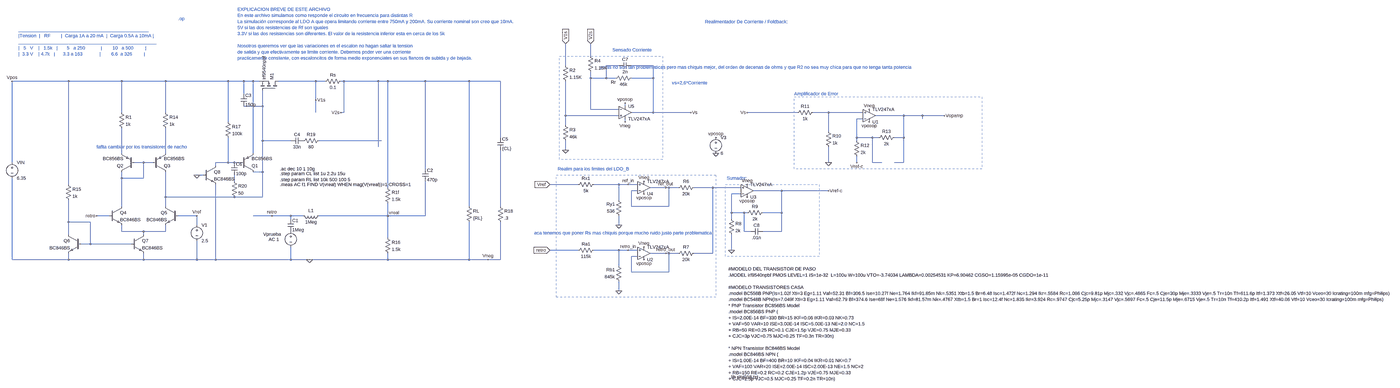
[diagram p0: schematic 2024-09-30 lazo de tension con capas de lazo corriente.asc, whole sheet]
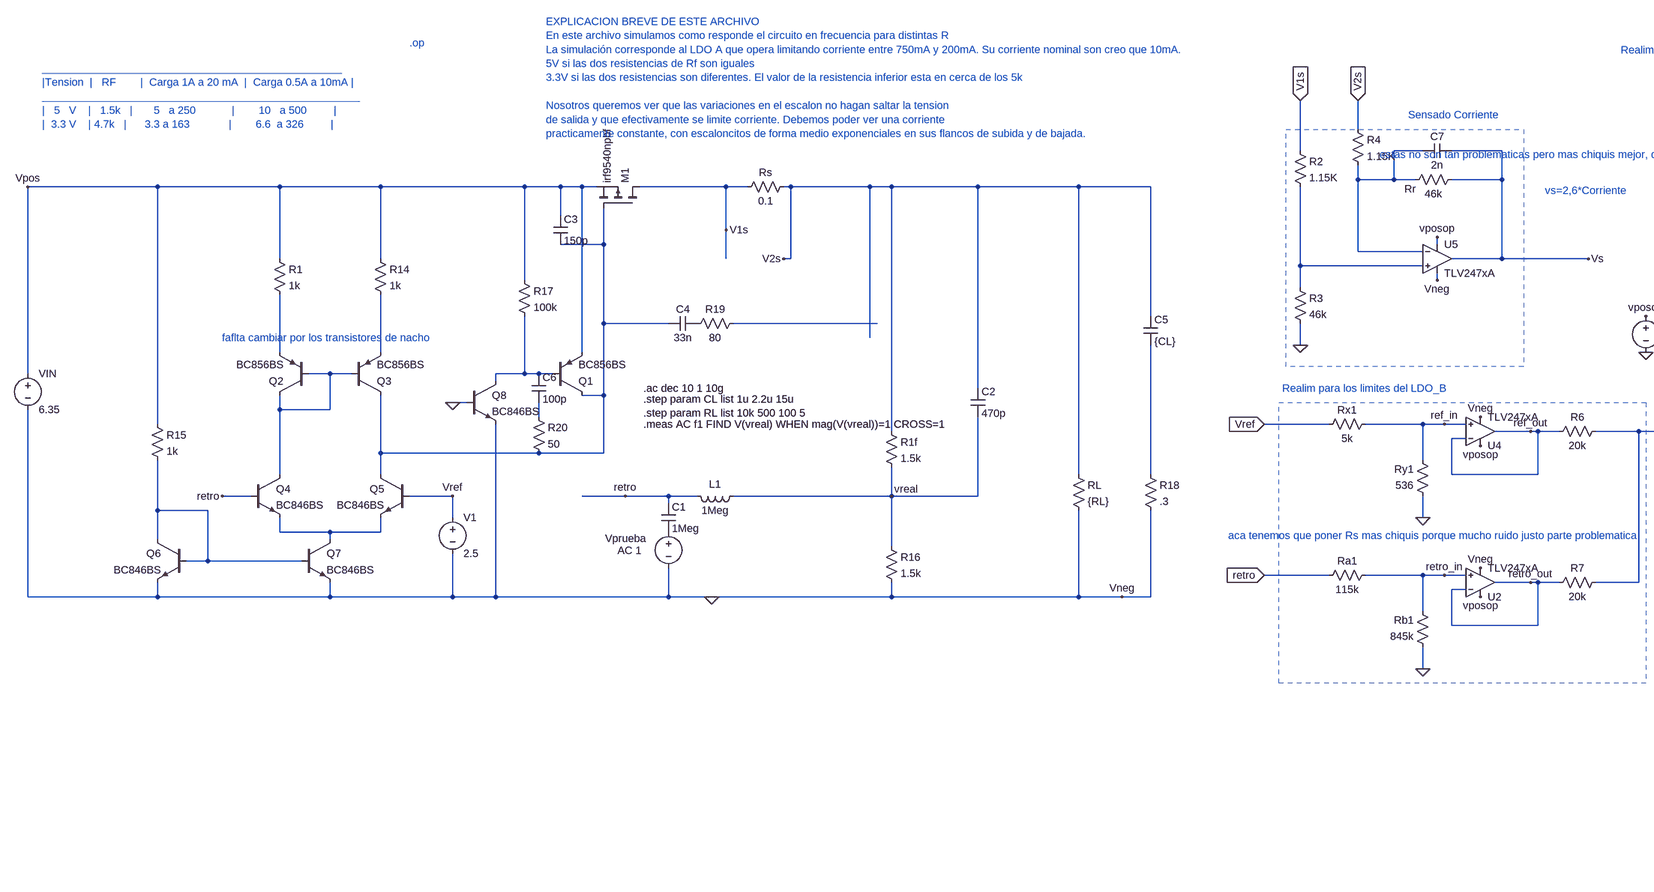
[diagram p1: schematic 2024-09-30 lazo de tension con capas de lazo corriente.asc, part, row 1 of 1, column 1 of 2]
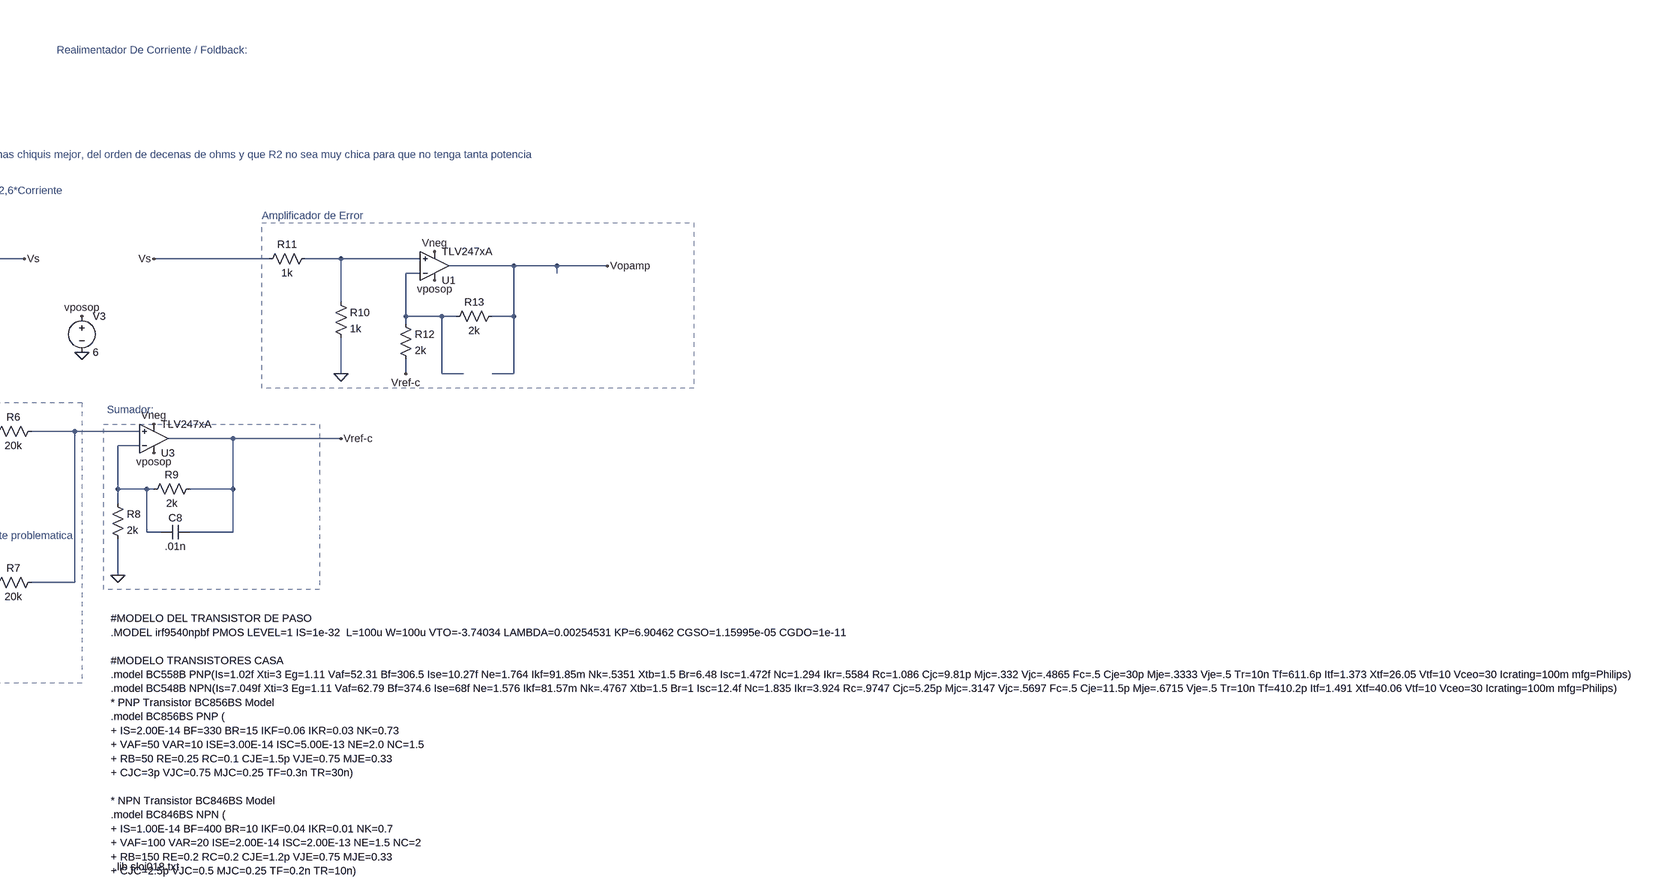
[diagram p2: schematic 2024-09-30 lazo de tension con capas de lazo corriente.asc, part, row 1 of 1, column 2 of 2]
2024-09-30 lazo de tension con capas de lazo corriente.asc, the LTspice schematic file:
Version 4
SHEET 1 6696 2024
WIRE 2176 -160 2176 -224
WIRE 2048 -112 2048 -224
WIRE 2320 -112 2256 -112
WIRE 2496 -112 2384 -112
WIRE 2176 -48 2176 -80
WIRE 2256 -48 2256 -112
WIRE 2256 -48 2176 -48
WIRE 2304 -48 2256 -48
WIRE 2496 -48 2496 -112
WIRE 2496 -48 2384 -48
WIRE -496 -32 -784 -32
WIRE -224 -32 -496 -32
WIRE 0 -32 -224 -32
WIRE 320 -32 0 -32
WIRE 400 -32 320 -32
WIRE 448 -32 400 -32
WIRE 480 -32 448 -32
WIRE 768 -32 576 -32
WIRE 816 -32 768 -32
WIRE 912 -32 896 -32
WIRE 1088 -32 912 -32
WIRE 1136 -32 1088 -32
WIRE 1328 -32 1136 -32
WIRE 1552 -32 1328 -32
WIRE 1712 -32 1552 -32
WIRE 400 32 400 -32
WIRE 768 64 768 -32
WIRE 496 96 496 16
WIRE 496 96 400 96
WIRE 2352 96 2352 80
WIRE 2176 112 2176 -48
WIRE 2320 112 2176 112
WIRE -224 128 -224 -32
WIRE 0 128 0 -32
WIRE 768 128 768 64
WIRE 912 128 912 -32
WIRE 912 128 896 128
WIRE 2496 128 2496 -48
WIRE 2496 128 2384 128
WIRE 2688 128 2496 128
WIRE 3232 128 2976 128
WIRE 3392 128 3312 128
WIRE 3568 128 3392 128
WIRE 2048 144 2048 -32
WIRE 2320 144 2048 144
WIRE 3776 144 3632 144
WIRE 3872 144 3776 144
WIRE 3984 144 3872 144
WIRE 3568 160 3536 160
WIRE 3872 160 3872 144
WIRE 320 176 320 -32
WIRE 2352 176 2352 160
WIRE 2048 192 2048 144
WIRE 3392 224 3392 128
WIRE 1712 256 1712 -32
WIRE 3536 256 3536 160
WIRE 3616 256 3536 256
WIRE 3648 256 3616 256
WIRE 3776 256 3776 144
WIRE 3776 256 3728 256
WIRE 496 272 496 96
WIRE 640 272 496 272
WIRE 1104 272 784 272
WIRE 3536 272 3536 256
WIRE 1088 304 1088 -32
WIRE 2048 320 2048 272
WIRE -224 336 -224 208
WIRE 0 336 0 208
WIRE 448 336 448 -32
WIRE -784 384 -784 -32
WIRE -112 384 -160 384
WIRE -64 384 -112 384
WIRE 320 384 320 256
WIRE 320 384 256 384
WIRE 352 384 320 384
WIRE 384 384 352 384
WIRE 3392 384 3392 304
WIRE 3536 384 3536 352
WIRE 3616 384 3616 256
WIRE 3664 384 3616 384
WIRE 3776 384 3776 256
WIRE 3776 384 3728 384
WIRE 256 400 256 384
WIRE 1328 416 1328 -32
WIRE 496 432 496 272
WIRE 496 432 448 432
WIRE 160 448 144 448
WIRE 192 448 160 448
WIRE -224 464 -224 432
WIRE -112 464 -112 384
WIRE -112 464 -224 464
WIRE 352 480 352 448
WIRE -496 496 -496 -32
WIRE 2112 496 1968 496
WIRE 2320 496 2192 496
WIRE 2368 496 2320 496
WIRE 2416 496 2368 496
WIRE 1136 512 1136 -32
WIRE 2560 512 2480 512
WIRE 2576 512 2560 512
WIRE 2624 512 2576 512
WIRE 2800 512 2704 512
WIRE 2944 512 2800 512
WIRE 2416 528 2384 528
WIRE 3152 528 3008 528
WIRE 3392 528 3152 528
WIRE 2944 544 2896 544
WIRE 0 560 0 432
WIRE 352 560 0 560
WIRE 496 560 496 432
WIRE 496 560 352 560
WIRE 2320 576 2320 496
WIRE -224 608 -224 464
WIRE 0 608 0 560
WIRE 1552 608 1552 -32
WIRE 1712 608 1712 320
WIRE 2384 608 2384 528
WIRE 2576 608 2576 512
WIRE 2576 608 2384 608
WIRE 2896 640 2896 544
WIRE 2960 640 2896 640
WIRE 2976 640 2960 640
WIRE 3152 640 3152 528
WIRE 3152 640 3056 640
WIRE -288 656 -352 656
WIRE 160 656 64 656
WIRE 544 656 448 656
WIRE 640 656 544 656
WIRE 704 656 640 656
WIRE 1136 656 1136 592
WIRE 1136 656 784 656
WIRE 1328 656 1328 480
WIRE 1328 656 1136 656
WIRE 640 672 640 656
WIRE 2896 672 2896 640
WIRE -496 688 -496 576
WIRE -384 688 -496 688
WIRE 160 704 160 656
WIRE 2320 704 2320 656
WIRE -224 736 -224 704
WIRE -112 736 -224 736
WIRE 0 736 0 704
WIRE 0 736 -112 736
WIRE 2960 736 2960 640
WIRE 2992 736 2960 736
WIRE 3152 736 3152 640
WIRE 3152 736 3056 736
WIRE -496 752 -496 688
WIRE -112 752 -112 736
WIRE 1136 768 1136 656
WIRE -384 800 -384 688
WIRE -384 800 -432 800
WIRE -176 800 -384 800
WIRE 2112 832 1968 832
WIRE 2320 832 2192 832
WIRE 2368 832 2320 832
WIRE 2416 832 2368 832
WIRE 2896 832 2896 752
WIRE 2560 848 2480 848
WIRE 2576 848 2560 848
WIRE 2624 848 2576 848
WIRE 2800 848 2800 512
WIRE 2800 848 2704 848
WIRE 2416 864 2384 864
WIRE -784 880 -784 464
WIRE -496 880 -496 848
WIRE -496 880 -784 880
WIRE -112 880 -112 848
WIRE -112 880 -496 880
WIRE 160 880 160 784
WIRE 160 880 -112 880
WIRE 256 880 256 496
WIRE 256 880 160 880
WIRE 640 880 640 816
WIRE 640 880 256 880
WIRE 736 880 640 880
WIRE 1136 880 1136 848
WIRE 1136 880 736 880
WIRE 1552 880 1552 688
WIRE 1552 880 1136 880
WIRE 1648 880 1552 880
WIRE 1712 880 1712 688
WIRE 1712 880 1648 880
WIRE 2320 912 2320 832
WIRE 2384 944 2384 864
WIRE 2576 944 2576 848
WIRE 2576 944 2384 944
WIRE 2320 1040 2320 992
FLAG 736 880 0
FLAG -784 -32 Vpos
FLAG 2688 128 Vs
FLAG 2048 -224 V1s
IOPIN 2048 -224 In
FLAG 2176 -224 V2s
IOPIN 2176 -224 In
FLAG 1968 496 Vref
IOPIN 1968 496 In
FLAG 1968 832 retro
IOPIN 1968 832 In
FLAG 3536 384 Vref-c
FLAG 2352 80 vposop
FLAG 3600 176 vposop
FLAG 2976 560 vposop
FLAG 2448 544 vposop
FLAG 2448 880 vposop
FLAG 2352 176 Vneg
FLAG 3600 112 Vneg
FLAG 2976 496 Vneg
FLAG 2448 816 Vneg
FLAG 2448 480 Vneg
FLAG 1648 880 Vneg
FLAG 2368 496 ref_in
FLAG 2368 832 retro_in
FLAG 2560 848 retro_out
FLAG 2560 512 ref_out
FLAG 160 656 Vref
FLAG 3984 144 Vopamp
FLAG -352 656 retro
FLAG 2048 320 0
FLAG 2320 1040 0
FLAG 2896 832 0
FLAG 3392 384 0
FLAG 2320 704 0
FLAG 3392 528 Vref-c
FLAG 544 656 retro
FLAG 768 64 V1s
FLAG 896 128 V2s
FLAG 2976 128 Vs
FLAG 2816 256 vposop
FLAG 2816 336 0
FLAG 160 448 0
FLAG 1136 656 vreal
DATAFLAG 1040 -32 ""
DATAFLAG 96 -32 ""
DATAFLAG 1216 -32 ""
SYMBOL res 1536 592 R0
SYMATTR InstName RL
SYMATTR Value {RL}
SYMBOL voltage -784 368 R0
WINDOW 123 24 124 Left 2
WINDOW 39 0 0 Left 0
SYMATTR InstName VIN
SYMATTR Value 6.35
SYMBOL res 1120 496 R0
SYMATTR InstName R1f
SYMATTR Value 1.5k
SYMBOL res 912 -48 R90
WINDOW 0 0 56 VBottom 2
WINDOW 3 32 56 VTop 2
SYMATTR InstName Rs
SYMATTR Value 0.1
SYMBOL Res 2032 -128 R0
SYMATTR InstName R2
SYMATTR Value 1.15K
SYMBOL Res 2032 176 R0
SYMATTR InstName R3
SYMATTR Value 46k
SYMBOL Res 2160 -176 R0
SYMATTR InstName R4
SYMATTR Value 1.15K
SYMBOL Res 2400 -64 R90
WINDOW 0 52 108 VBottom 2
WINDOW 3 32 56 VTop 2
SYMATTR InstName Rr
SYMATTR Value 46k
SYMBOL Res 2208 480 R90
WINDOW 0 0 56 VBottom 2
WINDOW 3 32 56 VTop 2
SYMATTR InstName Rx1
SYMATTR Value 5k
SYMBOL Res 2336 672 R180
WINDOW 0 36 76 Left 2
WINDOW 3 36 40 Left 2
SYMATTR InstName Ry1
SYMATTR Value 536
SYMBOL Res 2208 816 R90
WINDOW 0 0 56 VBottom 2
WINDOW 3 32 56 VTop 2
SYMATTR InstName Ra1
SYMATTR Value 115k
SYMBOL Res 2336 1008 R180
WINDOW 0 36 76 Left 2
WINDOW 3 36 40 Left 2
SYMATTR InstName Rb1
SYMATTR Value 845k
SYMBOL Res 2720 496 R90
WINDOW 0 0 56 VBottom 2
WINDOW 3 32 56 VTop 2
SYMATTR InstName R6
SYMATTR Value 20k
SYMBOL Res 2720 832 R90
WINDOW 0 0 56 VBottom 2
WINDOW 3 32 56 VTop 2
SYMATTR InstName R7
SYMATTR Value 20k
SYMBOL Res 2880 656 R0
SYMATTR InstName R8
SYMATTR Value 2k
SYMBOL Res 3072 624 R90
WINDOW 0 0 56 VBottom 2
WINDOW 3 32 56 VTop 2
SYMATTR InstName R9
SYMATTR Value 2k
SYMBOL Res 3376 208 R0
SYMATTR InstName R10
SYMATTR Value 1k
SYMBOL Res 3328 112 R90
WINDOW 0 0 56 VBottom 2
WINDOW 3 32 56 VTop 2
SYMATTR InstName R11
SYMATTR Value 1k
SYMBOL Res 3520 256 R0
SYMATTR InstName R12
SYMATTR Value 2k
SYMBOL Res 3744 240 R90
WINDOW 0 0 56 VBottom 2
WINDOW 3 32 56 VTop 2
SYMATTR InstName R13
SYMATTR Value 2k
SYMBOL pnp -160 432 R180
SYMATTR InstName Q2
SYMATTR Value BC856BS
SYMBOL pnp -64 432 M180
SYMATTR InstName Q3
SYMATTR Value BC856BS
SYMBOL npn -288 608 R0
SYMATTR InstName Q4
SYMATTR Value BC846BS
SYMBOL npn 64 608 M0
SYMATTR InstName Q5
SYMATTR Value BC846BS
SYMBOL res -240 112 R0
SYMATTR InstName R1
SYMATTR Value 1k
SYMBOL res -16 112 R0
SYMATTR InstName R14
SYMATTR Value 1k
SYMBOL res -512 480 R0
SYMATTR InstName R15
SYMATTR Value 1k
SYMBOL npn -432 752 M0
SYMATTR InstName Q6
SYMATTR Value BC846BS
SYMBOL npn -176 752 R0
SYMATTR InstName Q7
SYMATTR Value BC846BS
SYMBOL pmos 576 16 M270
SYMATTR InstName M1
SYMATTR Value irf9540npbf
SYMBOL voltage 640 720 R0
WINDOW 0 -141 30 Left 2
WINDOW 3 10 39 Left 2
WINDOW 123 -113 57 Left 2
WINDOW 39 0 0 Left 0
SYMATTR InstName Vprueba
SYMATTR Value ""
SYMATTR Value2 AC 1
SYMBOL pnp 384 432 M180
SYMATTR InstName Q1
SYMATTR Value BC856BS
SYMBOL npn 192 400 R0
SYMATTR InstName Q8
SYMATTR Value BC846BS
SYMBOL res 304 160 R0
SYMATTR InstName R17
SYMATTR Value 100k
SYMBOL opamp2 2976 592 M180
SYMATTR InstName U3
SYMATTR Value TLV247xA
SYMBOL opamp2 2448 912 M180
SYMATTR InstName U2
SYMATTR Value TLV247xA
SYMBOL opamp2 2448 576 M180
SYMATTR InstName U4
SYMATTR Value TLV247xA
SYMBOL opamp2 2352 64 R0
SYMATTR InstName U5
SYMATTR Value TLV247xA
SYMBOL opamp2 3600 208 M180
SYMATTR InstName U1
SYMATTR Value TLV247xA
SYMBOL Cap 384 32 R0
SYMATTR InstName C3
SYMATTR Value 150p
SYMBOL res 1120 752 R0
SYMATTR InstName R16
SYMATTR Value 1.5k
SYMBOL Cap 1696 256 R0
SYMATTR InstName C5
SYMATTR Value {CL}
SYMBOL cap 1312 416 R0
SYMATTR InstName C2
SYMATTR Value 470p
SYMBOL res 1696 592 R0
SYMATTR InstName R18
SYMATTR Value .3
SYMBOL voltage 2816 240 R0
SYMATTR InstName V3
SYMATTR Value 6
SYMBOL cap 704 256 R90
WINDOW 0 0 32 VBottom 2
WINDOW 3 32 32 VTop 2
SYMATTR InstName C4
SYMATTR Value 33n
SYMBOL res 800 256 R90
WINDOW 0 0 56 VBottom 2
WINDOW 3 32 56 VTop 2
SYMATTR InstName R19
SYMATTR Value 80
SYMBOL cap 336 384 R0
SYMATTR InstName C6
SYMATTR Value 100p
SYMBOL res 336 464 R0
SYMATTR InstName R20
SYMATTR Value 50
SYMBOL cap 624 672 R0
SYMATTR InstName C1
SYMATTR Value 1Meg
SYMBOL ind 800 640 R90
WINDOW 0 5 56 VBottom 2
WINDOW 3 32 56 VTop 2
SYMATTR InstName L1
SYMATTR Value 1Meg
SYMBOL voltage 160 688 R0
SYMATTR InstName V1
SYMATTR Value 2.5
SYMBOL cap 2384 -128 R90
WINDOW 0 0 32 VBottom 2
WINDOW 3 32 32 VTop 2
SYMATTR InstName C7
SYMATTR Value 2n
SYMBOL cap 3056 720 R90
WINDOW 0 0 32 VBottom 2
WINDOW 3 32 32 VTop 2
SYMATTR InstName C8
SYMATTR Value .01n
TEXT -752 -296 Left 2 ;__________________________________________________\n|Tension  |   RF        |  Carga 1A a 20 mA  |  Carga 0.5A a 10mA |\n_____________________________________________________\n|   5   V    |   1.5k   |       5   a 250            |        10   a 500         |\n|  3.3 V    | 4.7k   |      3.3 a 163             |        6.6  a 326         |
TEXT 2760 -336 Left 2 ;Realimentador De Corriente / Foldback:
TEXT 2288 -192 Left 2 ;Sensado Corriente
TEXT 2008 416 Left 2 ;Realim para los limites del LDO_B
TEXT 2872 464 Left 2 ;Sumador:
TEXT 3216 32 Left 2 ;Amplificador de Error
TEXT 2888 1480 Left 2 !.lib sloj018.txt
TEXT 2880 928 Left 2 !#MODELO DEL TRANSISTOR DE PASO\n.MODEL irf9540npbf PMOS LEVEL=1 IS=1e-32  L=100u W=100u VTO=-3.74034 LAMBDA=0.00254531 KP=6.90462 CGSO=1.15995e-05 CGDO=1e-11\n \n#MODELO TRANSISTORES CASA\n.model BC558B PNP(Is=1.02f Xti=3 Eg=1.11 Vaf=52.31 Bf=306.5 Ise=10.27f Ne=1.764 Ikf=91.85m Nk=.5351 Xtb=1.5 Br=6.48 Isc=1.472f Nc=1.294 Ikr=.5584 Rc=1.086 Cjc=9.81p Mjc=.332 Vjc=.4865 Fc=.5 Cje=30p Mje=.3333 Vje=.5 Tr=10n Tf=611.6p Itf=1.373 Xtf=26.05 Vtf=10 Vceo=30 Icrating=100m mfg=Philips)\n.model BC548B NPN(Is=7.049f Xti=3 Eg=1.11 Vaf=62.79 Bf=374.6 Ise=68f Ne=1.576 Ikf=81.57m Nk=.4767 Xtb=1.5 Br=1 Isc=12.4f Nc=1.835 Ikr=3.924 Rc=.9747 Cjc=5.25p Mjc=.3147 Vjc=.5697 Fc=.5 Cje=11.5p Mje=.6715 Vje=.5 Tr=10n Tf=410.2p Itf=1.491 Xtf=40.06 Vtf=10 Vceo=30 Icrating=100m mfg=Philips)\n* PNP Transistor BC856BS Model\n.model BC856BS PNP (\n+ IS=2.00E-14 BF=330 BR=15 IKF=0.06 IKR=0.03 NK=0.73\n+ VAF=50 VAR=10 ISE=3.00E-14 ISC=5.00E-13 NE=2.0 NC=1.5\n+ RB=50 RE=0.25 RC=0.1 CJE=1.5p VJE=0.75 MJE=0.33\n+ CJC=3p VJC=0.75 MJC=0.25 TF=0.3n TR=30n)\n \n* NPN Transistor BC846BS Model\n.model BC846BS NPN (\n+ IS=1.00E-14 BF=400 BR=10 IKF=0.04 IKR=0.01 NK=0.7\n+ VAF=100 VAR=20 ISE=2.00E-14 ISC=2.00E-13 NE=1.5 NC=2\n+ RB=150 RE=0.2 RC=0.2 CJE=1.2p VJE=0.75 MJE=0.33\n+ CJC=2.5p VJC=0.5 MJC=0.25 TF=0.2n TR=10n)
TEXT 584 440 Left 2 !.step param CL list 1u 2.2u 15u\n.step param RL list 10k 500 100 5
TEXT 2592 -24 Left 2 ;vs=2,6*Corriente
TEXT 64 -352 Left 2 ;.op
TEXT 1888 744 Left 2 ;aca tenemos que poner Rs mas chiquis porque mucho ruido justo parte problematica
TEXT 2224 -104 Left 2 ;estas no son tan problematicas pero mas chiquis mejor, del orden de decenas de ohms y que R2 no sea muy chica para que no tenga tanta potencia
TEXT -352 304 Left 2 ;faflta cambiar por los transistores de nacho
TEXT 368 -400 Left 2 ;EXPLICACION BREVE DE ESTE ARCHIVO\nEn este archivo simulamos como responde el circuito en frecuencia para distintas R\nLa simulación corresponde al LDO A que opera limitando corriente entre 750mA y 200mA. Su corriente nominal son creo que 10mA.\n5V si las dos resistencias de Rf son iguales\n3.3V si las dos resistencias son diferentes. El valor de la resistencia inferior esta en cerca de los 5k\n \nNosotros queremos ver que las variaciones en el escalon no hagan saltar la tension \nde salida y que efectivamente se limite corriente. Debemos poder ver una corriente \npracticamente constante, con escaloncitos de forma medio exponenciales en sus flancos de subida y de bajada.
TEXT 584 416 Left 2 !.ac dec 10 1 10g
TEXT 584 496 Left 2 !.meas AC f1 FIND V(vreal) WHEN mag(V(vreal))=1 CROSS=1
RECTANGLE Normal 3344 864 2864 496 2
RECTANGLE Normal 2816 1072 2000 448 2
RECTANGLE Normal 4176 416 3216 48 2
RECTANGLE Normal 2544 368 2016 -160 2

The netlist it stands for:
* 2024-09-30 lazo de tension con capas de lazo corriente.asc
RL V2s 0 {RL}
VIN Vpos 0 6.35
R1f V2s vreal 1.5k
Rs V2s V1s 0.1
R2 V1s N004 1.15K
R3 N004 0 46k
R4 V2s N001 1.15K
Rr Vs N001 46k
Rx1 ref_in Vref 5k
Ry1 0 ref_in 536
Ra1 retro_in retro 115k
Rb1 0 retro_in 845k
R6 N012 ref_out 20k
R7 N012 retro_out 20k
R8 N013 0 2k
R9 Vref-c N013 2k
R10 N003 0 1k
R11 N003 Vs 1k
R12 N005 Vref-c 2k
R13 Vopamp N005 2k
Q2 N009 N009 N007 0 BC856BS
Q3 N002 N009 N008 0 BC856BS
Q4 N009 retro N016 0 BC846BS
Q5 N002 Vref N016 0 BC846BS
R1 Vpos N007 1k
R14 Vpos N008 1k
R15 Vpos N015 1k
Q6 N015 N015 0 0 BC846BS
Q7 N016 N015 0 0 BC846BS
M1 V1s N002 Vpos Vpos irf9540npbf
Vprueba P001 0 AC 1
Q1 N002 N010 Vpos 0 BC856BS
Q8 N010 0 0 0 BC846BS
R17 Vpos N010 100k
XU3 N012 N013 vposop 0 Vref-c TLV247xA  ; pins In+ In- V+ V- OUT
XU2 retro_in retro_out vposop 0 retro_out TLV247xA  ; pins In+ In- V+ V- OUT
XU4 ref_in ref_out vposop 0 ref_out TLV247xA  ; pins In+ In- V+ V- OUT
XU5 N004 N001 vposop 0 Vs TLV247xA  ; pins In+ In- V+ V- OUT
XU1 N003 N005 vposop 0 Vopamp TLV247xA  ; pins In+ In- V+ V- OUT
C3 Vpos N002 150p
R16 vreal 0 1.5k
C5 V2s N014 {CL}
C2 V2s vreal 470p
R18 N014 0 .3
V3 vposop 0 6
C4 P002 N002 33n
R19 N006 P002 80
C6 N010 N011 100p
R20 N011 N002 50
C1 retro P001 1Meg
L1 vreal retro 1Meg
V1 Vref 0 2.5
C7 Vs N001 2n
C8 Vref-c N013 .01n
.model NPN NPN
.model PNP PNP
.lib standard.bjt
.model NMOS NMOS
.model PMOS PMOS
.lib standard.mos
* __________________________________________________
* |Tension  |   RF        |  Carga 1A a 20 mA  |  Carga 0.5A a 10mA |
* _____________________________________________________
* |   5   V    |   1.5k   |       5   a 250            |        10   a 500         |
* |  3.3 V    | 4.7k   |      3.3 a 163             |        6.6  a 326         |
* Realimentador De Corriente / Foldback:
* Sensado Corriente
* Realim para los limites del LDO_B
* Sumador:
* Amplificador de Error
.lib sloj018.txt
#MODELO DEL TRANSISTOR DE PASO
.MODEL irf9540npbf PMOS LEVEL=1 IS=1e-32  L=100u W=100u VTO=-3.74034 LAMBDA=0.00254531 KP=6.90462 CGSO=1.15995e-05 CGDO=1e-11
#MODELO TRANSISTORES CASA
.model BC558B PNP(Is=1.02f Xti=3 Eg=1.11 Vaf=52.31 Bf=306.5 Ise=10.27f Ne=1.764 Ikf=91.85m Nk=.5351 Xtb=1.5 Br=6.48 Isc=1.472f Nc=1.294 Ikr=.5584 Rc=1.086 Cjc=9.81p Mjc=.332 Vjc=.4865 Fc=.5 Cje=30p Mje=.3333 Vje=.5 Tr=10n Tf=611.6p Itf=1.373 Xtf=26.05 Vtf=10 Vceo=30 Icrating=100m mfg=Philips)
.model BC548B NPN(Is=7.049f Xti=3 Eg=1.11 Vaf=62.79 Bf=374.6 Ise=68f Ne=1.576 Ikf=81.57m Nk=.4767 Xtb=1.5 Br=1 Isc=12.4f Nc=1.835 Ikr=3.924 Rc=.9747 Cjc=5.25p Mjc=.3147 Vjc=.5697 Fc=.5 Cje=11.5p Mje=.6715 Vje=.5 Tr=10n Tf=410.2p Itf=1.491 Xtf=40.06 Vtf=10 Vceo=30 Icrating=100m mfg=Philips)
* PNP Transistor BC856BS Model
.model BC856BS PNP (
+ IS=2.00E-14 BF=330 BR=15 IKF=0.06 IKR=0.03 NK=0.73
+ VAF=50 VAR=10 ISE=3.00E-14 ISC=5.00E-13 NE=2.0 NC=1.5
+ RB=50 RE=0.25 RC=0.1 CJE=1.5p VJE=0.75 MJE=0.33
+ CJC=3p VJC=0.75 MJC=0.25 TF=0.3n TR=30n)
* NPN Transistor BC846BS Model
.model BC846BS NPN (
+ IS=1.00E-14 BF=400 BR=10 IKF=0.04 IKR=0.01 NK=0.7
+ VAF=100 VAR=20 ISE=2.00E-14 ISC=2.00E-13 NE=1.5 NC=2
+ RB=150 RE=0.2 RC=0.2 CJE=1.2p VJE=0.75 MJE=0.33
+ CJC=2.5p VJC=0.5 MJC=0.25 TF=0.2n TR=10n)
.step param CL list 1u 2.2u 15u
.step param RL list 10k 500 100 5
* vs=2,6*Corriente
* .op
* aca tenemos que poner Rs mas chiquis porque mucho ruido justo parte problematica
* estas no son tan problematicas pero mas chiquis mejor, del orden de decenas de ohms y que R2 no sea muy chica para que no tenga tanta potencia
* faflta cambiar por los transistores de nacho
* EXPLICACION BREVE DE ESTE ARCHIVO
* En este archivo simulamos como responde el circuito en frecuencia para distintas R
* La simulación corresponde al LDO A que opera limitando corriente entre 750mA y 200mA. Su corriente nominal son creo que 10mA.
* 5V si las dos resistencias de Rf son iguales
* 3.3V si las dos resistencias son diferentes. El valor de la resistencia inferior esta en cerca de los 5k
* Nosotros queremos ver que las variaciones en el escalon no hagan saltar la tension
* de salida y que efectivamente se limite corriente. Debemos poder ver una corriente
* practicamente constante, con escaloncitos de forma medio exponenciales en sus flancos de subida y de bajada.
.ac dec 10 1 10g
.meas AC f1 FIND V(vreal) WHEN mag(V(vreal))=1 CROSS=1
.backanno
.end